# EAGLE design openThermostatShield (EAGLE 6.4)
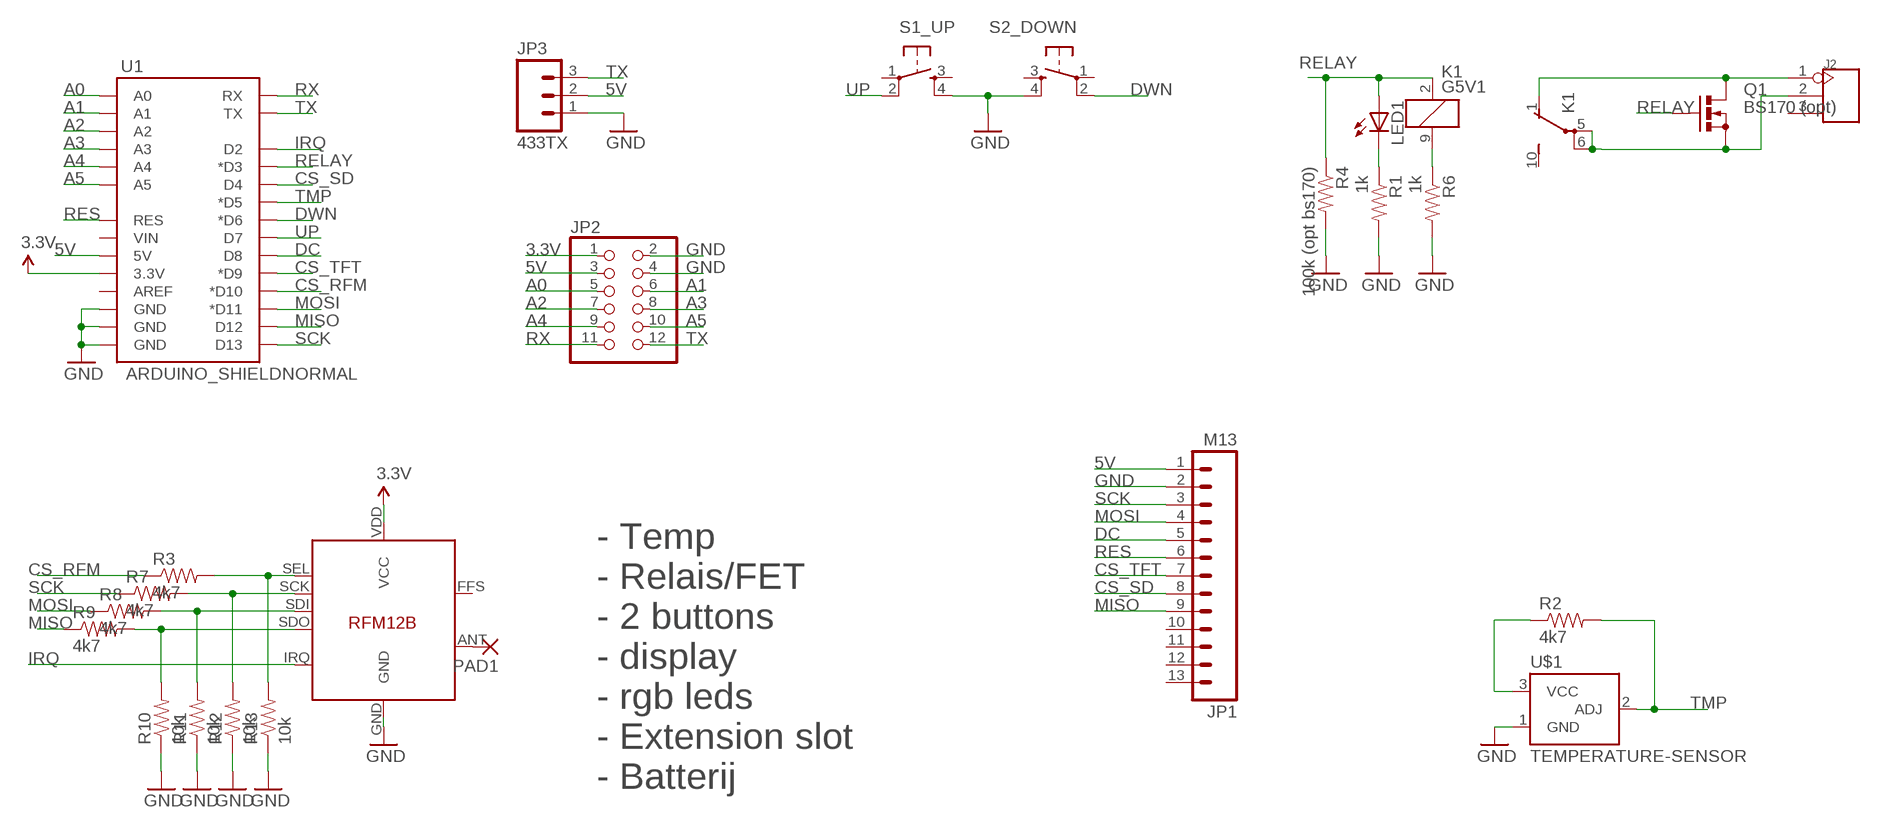
[diagram p0: schematic, sheet 1]

## Parts
J2  SCREW-TERMINAL-3P'5.08'  [3P-5.08]
JP1  M13  [1X13]
JP2  PINHD-2X6/90  [2X06/90]
JP3  433TX  M03POLAR  [MOLEX-1X3]
K1  G5V1  [G5V1]
LED1  LED-3MM-NO_SILK  [LED3MM-NS]
PAD1  1,6/0,8  [1,6/0,8]
Q1  BS170 (opt)  BS170  [SOT54E]
R1  1k  RESISTORAXIAL-0.3  [AXIAL-0.3]
R2  4k7  RESISTORAXIAL-0.3  [AXIAL-0.3]
R3  4k7  RESISTORAXIAL-0.3  [AXIAL-0.3]
R4  100k (opt bs170)  RESISTORAXIAL-0.3  [AXIAL-0.3]
R6  1k  RESISTORAXIAL-0.3  [AXIAL-0.3]
R7  4k7  RESISTORAXIAL-0.3  [AXIAL-0.3]
R8  4k7  RESISTORAXIAL-0.3  [AXIAL-0.3]
R9  4k7  RESISTORAXIAL-0.3  [AXIAL-0.3]
R10  10k  RESISTORAXIAL-0.3  [AXIAL-0.3]
R11  10k  RESISTORAXIAL-0.3  [AXIAL-0.3]
R12  10k  RESISTORAXIAL-0.3  [AXIAL-0.3]
R13  10k  RESISTORAXIAL-0.3  [AXIAL-0.3]
S1_UP  TAC_SWITCHPTH  [TACTILE-PTH]
S2_DOWN  TAC_SWITCHPTH  [TACTILE-PTH]
U1  ARDUINO_SHIELDNORMAL  [DUEMILANOVE_SHIELD_5X5]
U$1  TEMPERATURE-SENSOR  [TO-92]
U$2  RFM12B  [RFM12B]

## Nets
3.3V [power]: JP2.1 U1.3.3V U$2.VDD(VCC)
5V [power]: JP1.1 JP2.3 JP3.2 U1.5V
A0: JP2.5 U1.A0
A1: JP2.6 U1.A1
A2: JP2.7 U1.A2
A3: JP2.8 U1.A3
A4: JP2.9 U1.A4
A5: JP2.10 U1.A5
CS_RFM: R3.P$1 U1.D10(*D10)
CS_SD: JP1.8 U1.D4
CS_TFT: JP1.7 U1.D9(*D9)
DC: JP1.5 U1.D8
DWN: S2_DOWN.2 U1.D6(*D6)
GND [power]: JP1.2 JP2.2 JP2.4 JP3.1 R1.P$2 R4.P$2 R6.P$2 R10.P$1 R11.P$1 R12.P$1 R13.P$1 S1_UP.4 S2_DOWN.4 U1.GND@0(GND) U1.GND@1(GND) U1.GND@2(GND) U$1.1(GND) U$2.GND
IRQ: U1.D2 U$2.IRQ
MISO: JP1.9 R9.P$1 U1.D12
MOSI: JP1.4 R8.P$1 U1.D11(*D11)
N$1: K1.9 R6.P$1
N$2: J2.1 K1.1(2:O) Q1.D
N$3: LED1.K(C) R1.P$1
N$4: J2.2 K1.5(2:P) K1.6(2:P) Q1.S
N$8: R2.P$1 U$1.3(VCC)
N$11: PAD1.1(P) U$2.ANT
N$12: R9.P$2 R10.P$2 U$2.SDO
N$13: R8.P$2 R11.P$2 U$2.SDI
N$14: R7.P$2 R12.P$2 U$2.SCK
N$15: R3.P$2 R13.P$2 U$2.SEL
RELAY: K1.2 LED1.A Q1.G R4.P$1 U1.D3(*D3)
RES: JP1.6 U1.RES
RX: JP2.11 U1.RX
SCK: JP1.3 R7.P$1 U1.D13
TMP: R2.P$2 U1.D5(*D5) U$1.2(ADJ)
TX: JP2.12 JP3.3 U1.TX
UP: S1_UP.2 U1.D7
Unconnected: J2.3 JP1.10 JP1.11 JP1.12 JP1.13 K1.10(2:S) S1_UP.1 S1_UP.3 S2_DOWN.1 S2_DOWN.3 U1.AREF U1.VIN U$2.FFS

## Notes on the sheet
- - Temp
  - Relais/FET
  - 2 buttons
  - display
  - rgb leds
  - Extension slot
  - Batterij

## Library data of the parts
J2 = Connector:SCREW-TERMINAL-3P
JP1 = SparkFun-Connectors:M13: 13-pin single row .1" header
JP2 = pinhead:PINHD-2X6: PIN HEADER
JP3 = SparkFun-Connectors:M03: Header 3 Standard 3-pin 0.1" header. Use with straight break away headers (SKU : PRT-00116), right angle break away headers (PRT-00553), swiss pins (PRT-00743), machine pins (PRT-00117), and female headers (PRT-00115). Molex polarized connector foot print use with SKU : PRT-08232 with associated crimp pins and housings.
K1 = relay:G5V1: RELAY 1 x switch, 0.5 A/125 V AC, 1 A/24 V DC , Omron; MPN: G5V-1-DC24; OC_FARNELL: 9949593; OC_NEWARK: 36M6377
LED1 = SparkFun-LED:LED: LEDs Standard schematic elements and footprints for 5mm, 3mm, 1206, and 0603 sized LEDs. 5mm - Spark Fun Electronics SKU : COM-00529 (and others)
PAD1 = wirepad:1,6/0,8: THROUGH-HOLE PAD
Q1 = transistor-small-signal:BS170: N-CHANNEL MOS FET
R1-R4 R6-R13 = SparkFun-Passives:RESISTOR: Resistor Basic schematic elements and footprints for 0603, 1206, and PTH resistors.
S1_UP S2_DOWN = SparkFun-Electromechanical:TAC_SWITCH: Momentary Switch Button commonly used for reset or general input. Spark Fun Electronics SKU : COM-00097 SMT- SWCH-08247
U1 = SparkFun-Boards:ARDUINO_SHIELD: Arduino shield footprint
U$1 = SparkFun-Sensors:TEMPERATURE-SENSOR: TO-92 temp sensor
U$2 = JeeLabs:RFM12B

## Net classes
1 power: width 0.381 mm, clearance 0.254 mm

## Board
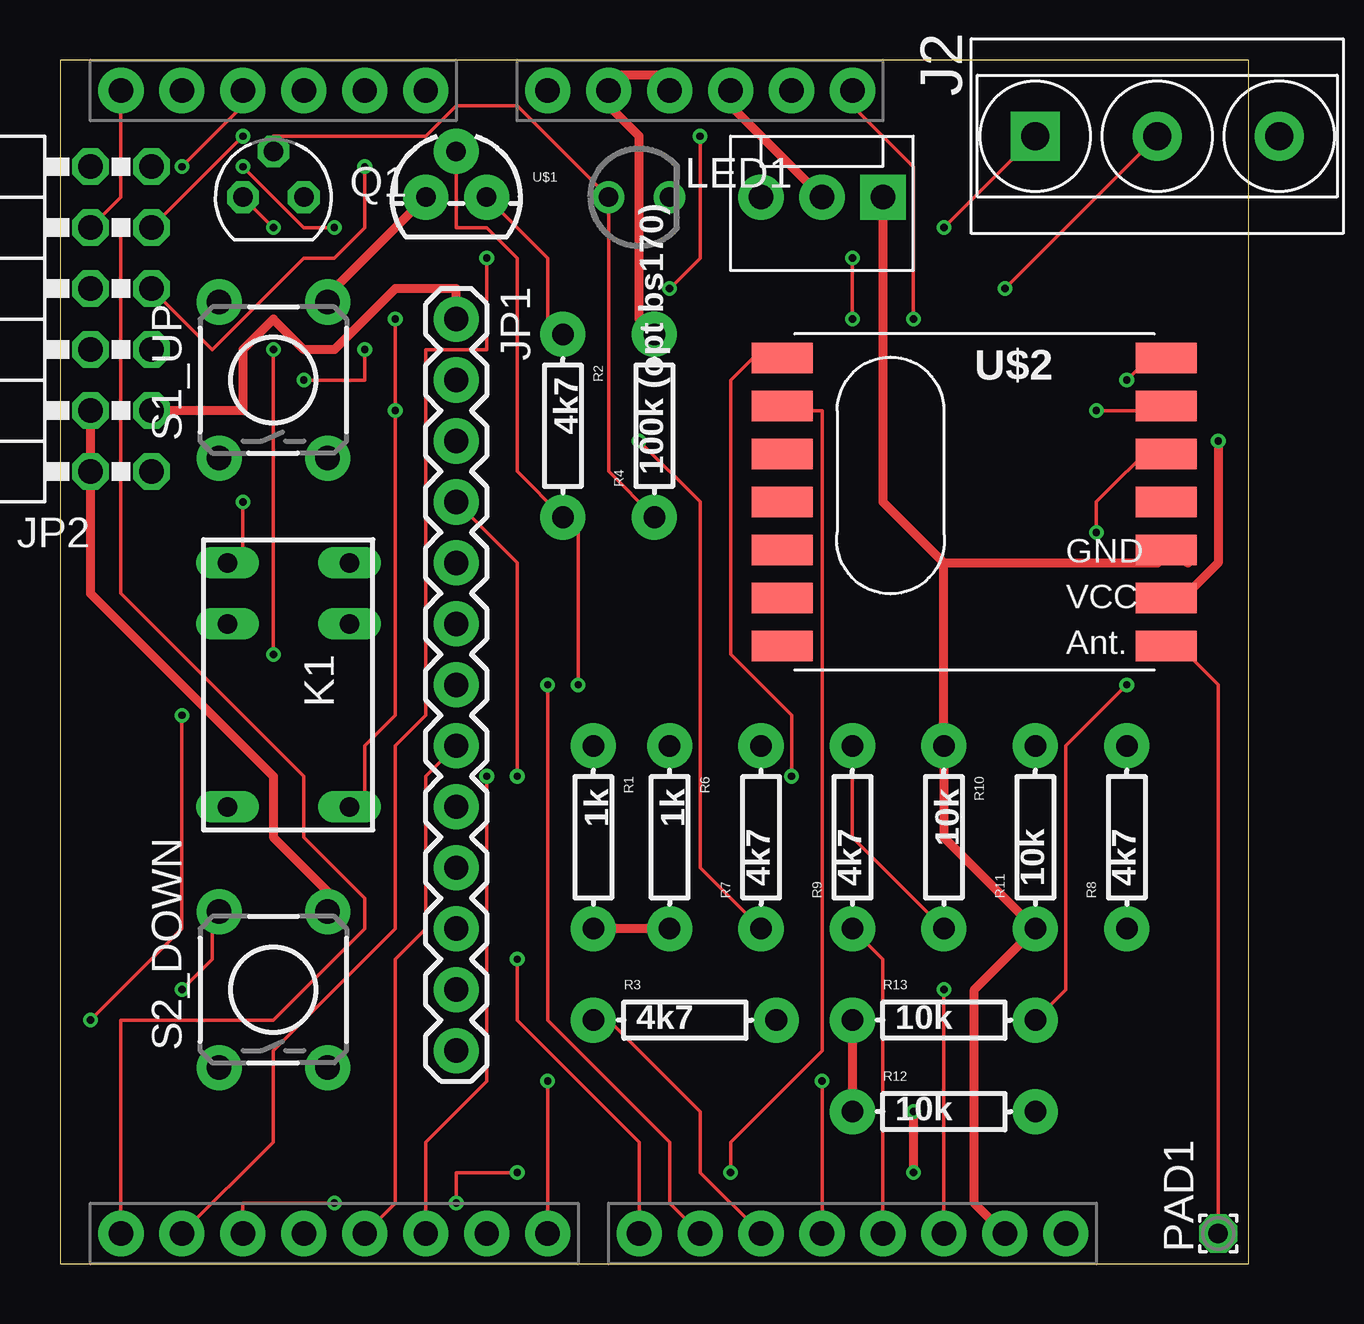
[diagram p1: board, top side]
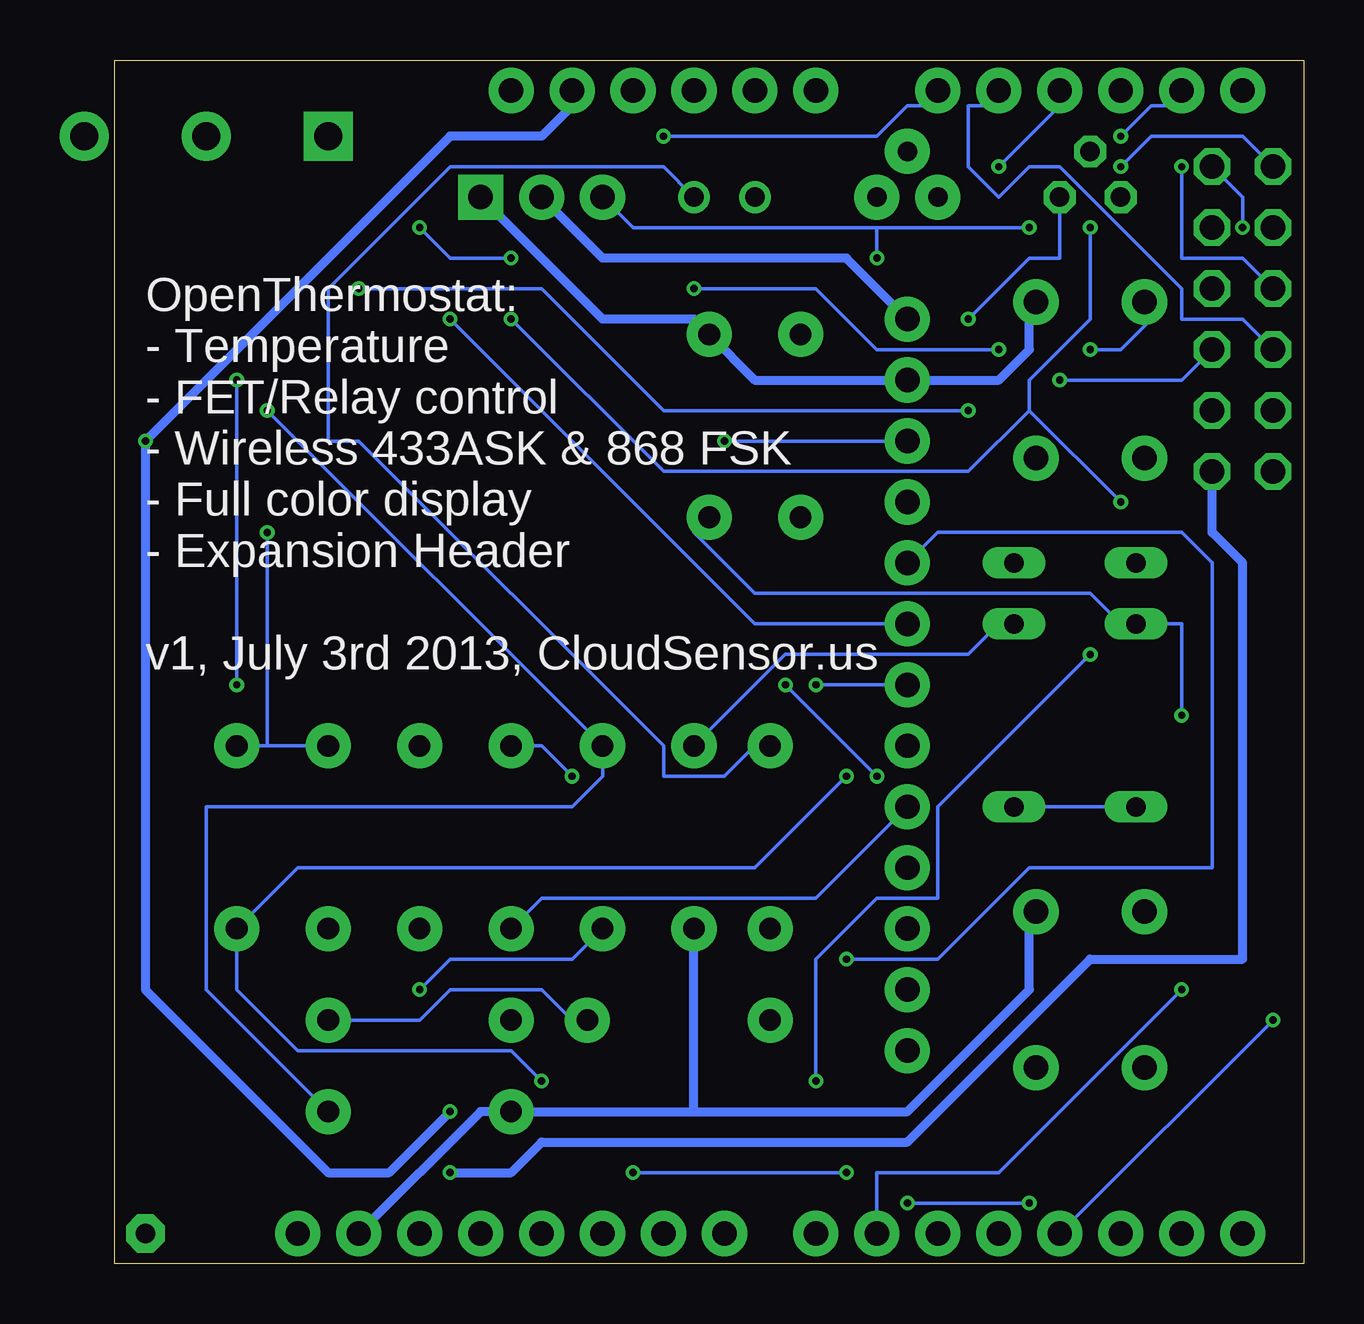
[diagram p2: board, bottom side, seen from below]

Size 49.53 x 50.17 mm. Coordinates in mm from the lower left corner, seen from the top.
Copper layers (1*16): Top 0.035mm / dielectric 1.5mm / Bottom 0.035mm
Design rules "ITEADstudio_DRC": minimum track width 6mil, minimum drill 12mil, track to track 6mil, track to pad 6mil, pad to pad 6mil, via to via 6mil, smd to smd 0mil, copper to edge 10mil, drill to drill 10mil, minimum pad ring 10mil, minimum via ring 6mil, stop-mask expansion 2mil, vias tented up to drill 100mil, thermal gap 10mil

### Footprints (pad centres in the part's own frame; a part is rotated, then mirrored left to right if it is on the bottom)
3P-5.08 = drill 1.168 pad 2.032 square: 1 0,5.08 | drill 1.168 pad 2.032: 2 0,0; 3 0,-5.08
1X13 = drill 1.016 pad 1.88: 1 0,0; 2 2.54,0; 3 5.08,0; 4 7.62,0; 5 10.16,0; 6 12.7,0; 7 15.24,0; 8 17.78,0; 9 20.32,0; 10 22.86,0; 11 25.4,0; 12 27.94,0; 13 30.48,0
2X06/90 = drill 1.016 octagon: 1 -6.35,-6.35; 2 -6.35,-3.81; 3 -3.81,-6.35; 4 -3.81,-3.81; 5 -1.27,-6.35; 6 -1.27,-3.81; 7 1.27,-6.35; 8 1.27,-3.81; 9 3.81,-6.35; 10 3.81,-3.81; 11 6.35,-6.35; 12 6.35,-3.81
MOLEX-1X3 = drill 1.016 pad 1.88 square: 1 0,0 | drill 1.016 pad 1.88: 2 2.54,0; 3 5.08,0
G5V1 = drill 0.813 long: 1 -5.08,-2.54; 2 -2.54,-2.54; 5 5.08,-2.54; 6 5.08,2.54; 9 -2.54,2.54; 10 -5.08,2.54
LED3MM-NS = drill 0.813: A -1.27,0; K 1.27,0
1,6/0,8 = drill 0.813 pad 1.6 octagon: 1 0,0
SOT54E = drill 0.813 octagon: D -1.27,0; G 0,1.905; S 1.27,0
AXIAL-0.3 = drill 0.9 pad 1.88: P$1 -3.81,0; P$2 3.81,0
TACTILE-PTH = drill 1.016 pad 1.88: 1 -3.251,2.261; 2 3.251,2.261; 3 -3.251,-2.261; 4 3.251,-2.261
DUEMILANOVE_SHIELD_5X5 = drill 1.016 pad 1.88: 3.3V 50.165,26.67; 5V 50.165,29.21; A0 50.165,41.91; A1 50.165,44.45; A2 50.165,46.99; A3 50.165,49.53; A4 50.165,52.07; A5 50.165,54.61; AREF 2.54,15.24; D2 2.54,49.53; D3 2.54,46.99; D4 2.54,44.45; D5 2.54,41.91; D6 2.54,39.37; D7 2.54,36.83; D8 2.54,33.02; D9 2.54,30.48; D10 2.54,27.94; D11 2.54,25.4; D12 2.54,22.86; D13 2.54,20.32; GND@0 50.165,31.75; GND@1 50.165,34.29; GND@2 2.54,17.78; RES 50.165,24.13; RX 2.54,54.61; TX 2.54,52.07; VIN 50.165,36.83
TO-92 = drill 0.813 pad 1.88: 1 -1.27,0; 2 0,1.905; 3 1.27,0
RFM12B = smd 2.54 x 1.27: ANT 8,-6; FFS -8,2; GND 8,-2; IRQ -8,4; P$8 -8,0; P$9 -8,-2; P$10 -8,-4; P$12 -8,-6; P$16 8,0; SCK 8,4; SDI 8,2; SDO -8,6; SEL 8,6; VDD 8,-4

### Placement (x,y rotation side)
J2  45.72,46.99 90 top
JP1  16.51,39.37 270 top
JP2  -2.54,39.37 90 top
JP3  34.29,44.45 180 top
K1  9.52,24.13 270 top
LED1  24.13,44.45 0 top
PAD1  48.26,1.27 90 top
Q1  8.89,44.45 0 top
R1  22.22,17.78 270 top
R2  20.95,34.93 270 top
R3  26.03,10.16 0 top
R4  24.76,34.93 90 top
R6  25.4,17.78 270 top
R7  29.21,17.78 90 top
R8  44.45,17.78 90 top
R9  33.02,17.78 90 top
R10  36.83,17.78 270 top
R11  40.64,17.78 90 top
R12  36.83,6.35 0 top
R13  36.83,10.16 0 top
S1_UP  8.89,36.83 90 top
S2_DOWN  8.89,11.43 90 top
U1  57.15,-1.27 90 top
U$1  16.51,44.45 0 top
U$2  38.1,31.75 0 top

### Tracks (layer width: path | path; a pad name or v marks a point on that pad's centre or on a via)
3.3V  (via drill 0.3)
  Top 0.381: v48.26,34.29 48.26,29.21 46.99,27.94 U$2.VDD | v35.56,6.35 v35.56,3.81
  Bottom 0.381: U1.3.3V 30.48,48.26 31.75,46.99 35.56,46.99 v48.26,34.29 48.26,11.43 40.64,3.81 38.1,3.81 v35.56,6.35 | JP2.1 3.81,30.48 2.54,29.21 2.54,12.7 8.89,12.7 16.51,5.08 31.75,5.08 33.02,3.81 v35.56,3.81
5V
  Top 0.381: JP3.2 27.94,48.26 U1.5V | JP2.3 7.62,35.56 7.62,38.1 8.89,39.37 10.16,38.1 11.43,38.1 13.97,40.64 16.51,40.64 JP1.1
  Bottom 0.381: JP3.2 29.21,41.91 19.05,41.91 JP1.1
A0  (via drill 0.3)
  Top 0.152: v10.16,36.83 12.7,36.83 v12.7,38.1 | v25.4,40.64 26.67,41.91 v26.67,46.99
  Bottom 0.152: JP2.5 5.08,36.83 v10.16,36.83 | v12.7,38.1 17.78,38.1 20.32,40.64 v25.4,40.64 | v26.67,46.99 17.78,46.99 16.51,48.26 15.24,48.26 U1.A0
A1
  Bottom 0.152: JP2.6 2.54,39.37 5.08,39.37 5.08,40.64 10.16,45.72 11.43,45.72 12.7,44.45 13.97,45.72 13.97,48.26 12.7,48.26 U1.A1
A2  (via drill 0.3)
  Top 0.152: JP2.7 6.35,38.1 10.16,41.91 11.43,41.91 12.7,43.18 v12.7,45.72
  Bottom 0.152: v12.7,45.72 10.16,48.26 U1.A2
A3  (via drill 0.3)
  Top 0.152: v5.08,45.72 7.62,48.26 U1.A3
  Bottom 0.152: JP2.8 2.54,41.91 5.08,41.91 v5.08,45.72
A4  (via drill 0.3)
  Top 0.152: v7.62,46.99 JP2.9
  Bottom 0.152: v7.62,46.99 6.35,48.26 5.08,48.26 U1.A4
A5
  Top 0.152: JP2.10 2.54,44.45 U1.A5
CS_RFM
  Top 0.152: U1.D10 26.67,3.81 26.67,6.35 22.86,10.16 R3.P$1
CS_SD
  Top 0.152: U1.D4 13.97,2.54 13.97,12.7 15.24,13.97 15.24,20.32 JP1.8
CS_TFT  (via drill 0.3)
  Top 0.152: v20.32,24.13 20.32,10.16 25.4,5.08 25.4,2.54 U1.D9
  Bottom 0.152: v20.32,24.13 JP1.7
DC  (via drill 0.3)
  Top 0.152: v19.05,12.7 19.05,10.16 24.13,5.08 U1.D8
  Bottom 0.152: JP1.5 15.24,30.48 5.08,30.48 3.81,29.21 3.81,16.51 11.43,16.51 15.24,12.7 v19.05,12.7
DWN  (via drill 0.3)
  Top 0.152: v5.08,11.43 6.35,12.7 6.35,13.97 S2_DOWN.2
  Bottom 0.152: U1.D6 17.78,3.81 12.7,3.81 v5.08,11.43
GND
  Top 0.381: 46.99,29.21 U$2.GND 45.72,29.21 36.83,29.21 | 36.83,29.21 R10.P$1 36.83,17.78 R11.P$1 38.1,11.43 38.1,2.54 U1.GND@2 | U$1.1 11.43,40.64 S1_UP.4 | U1.GND@0 25.4,49.53 22.86,49.53 U1.GND@1 22.86,48.26 24.13,46.99 24.13,39.37 R4.P$2 | 36.83,29.21 34.29,31.75 JP3.1 | JP2.4 JP2.2 1.27,27.94 8.89,20.32 8.89,17.78 11.43,15.24 S2_DOWN.4 | R6.P$2 R1.P$2 | R13.P$1 R12.P$1
  Bottom 0.381: JP3.1 29.21,39.37 25.4,39.37 R4.P$2 22.86,36.83 JP1.2 12.7,36.83 11.43,38.1 11.43,39.37 S1_UP.4 | U1.GND@2 34.29,6.35 R12.P$1 25.4,6.35 | 25.4,6.35 R6.P$2 | 25.4,6.35 16.51,6.35 11.43,11.43 11.43,13.97 S2_DOWN.4
IRQ  (via drill 0.3)
  Top 0.152: v27.94,3.81 27.94,5.08 31.75,8.89 31.75,35.56 30.48,35.56 U$2.IRQ | v19.05,3.81 16.51,3.81 v16.51,2.54 | v11.43,2.54 7.62,2.54 U1.D2
  Bottom 0.152: v19.05,3.81 v27.94,3.81 | v11.43,2.54 v16.51,2.54
MISO
  Top 0.152: R9.P$1 34.29,12.7 U1.D12
  Bottom 0.152: JP1.9 20.32,15.24 31.75,15.24 R9.P$1
MOSI  (via drill 0.3)
  Top 0.152: v31.75,7.62 U1.D11 | JP1.4 19.05,29.21 v19.05,20.32
  Bottom 0.152: v31.75,7.62 33.02,8.89 41.91,8.89 44.45,11.43 R8.P$1 41.91,16.51 22.86,16.51 v19.05,20.32
N$1
  Bottom 0.152: R6.P$1 21.59,25.4 13.97,25.4 12.7,26.67 K1.9
N$2  (via drill 0.3)
  Top 0.152: v7.62,31.75 7.62,29.21 K1.1 | Q1.D v8.89,43.18 | v36.83,43.18 J2.1 | v33.02,39.37 v33.02,41.91
  Bottom 0.152: 11.43,35.56 v7.62,31.75 | 11.43,35.56 11.43,36.83 8.89,39.37 v8.89,43.18 | v36.83,43.18 35.56,41.91 v33.02,41.91 | v33.02,39.37 26.67,33.02 13.97,33.02 11.43,35.56
N$3
  Bottom 0.152: LED1.K 26.67,45.72 35.56,45.72 40.64,40.64 40.64,34.29 39.37,34.29 26.67,21.59 26.67,20.32 24.13,20.32 22.86,21.59 R1.P$1
N$4  (via drill 0.3)
  Top 0.152: v13.97,39.37 v13.97,35.56 13.97,22.86 12.7,21.59 12.7,19.05 K1.6 | v39.37,40.64 J2.2
  Bottom 0.152: K1.6 K1.5 | Q1.S 10.16,41.91 11.43,41.91 v13.97,39.37 | v39.37,40.64 31.75,40.64 26.67,35.56 v13.97,35.56
N$8
  Top 0.152: U$1.3 20.32,41.91 20.32,39.37 R2.P$1
N$11
  Top 0.152: PAD1.1 48.26,24.13 46.99,25.4 U$2.ANT
N$12  (via drill 0.3)
  Top 0.152: v30.48,20.32 30.48,22.86 27.94,25.4 27.94,36.83 29.21,38.1 U$2.SDO | R10.P$2 33.02,17.78 R9.P$2
  Bottom 0.152: v30.48,20.32 31.75,21.59 R9.P$2
N$13  (via drill 0.3)
  Top 0.152: v43.18,30.48 43.18,31.75 45.72,34.29 U$2.SDI
  Bottom 0.152: 43.18,21.59 v43.18,30.48 | R8.P$2 43.18,21.59 | 43.18,21.59 R11.P$2
N$14  (via drill 0.3)
  Top 0.152: v43.18,35.56 45.72,35.56 U$2.SCK
  Bottom 0.152: v43.18,35.56 R7.P$2 29.21,20.32 30.48,19.05 45.72,19.05 45.72,11.43 R12.P$2
N$15  (via drill 0.3)
  Top 0.152: v44.45,36.83 45.72,38.1 U$2.SEL | v44.45,24.13 41.91,21.59 41.91,11.43 R13.P$2
  Bottom 0.152: v44.45,24.13 v44.45,36.83 | R13.P$2 36.83,10.16 35.56,11.43 31.75,11.43 30.48,10.16 R3.P$2
RELAY  (via drill 0.3)
  Top 0.152: R4.P$1 22.86,33.02 LED1.A 19.05,48.26 16.51,48.26 15.24,46.99 8.89,46.99 Q1.G | v1.27,10.16 5.08,13.97 v5.08,22.86
  Bottom 0.152: R4.P$1 25.4,30.48 22.86,27.94 8.89,27.94 7.62,26.67 K1.2 5.08,26.67 v5.08,22.86 | v1.27,10.16 U1.D3
RES  (via drill 0.3)
  Top 0.152: v35.56,39.37 35.56,45.72 33.02,48.26 U1.RES
  Bottom 0.152: JP1.6 22.86,26.67 v35.56,39.37
RX  (via drill 0.3)
  Top 0.152: v2.54,43.18 2.54,27.94 10.16,20.32 10.16,17.78 12.7,15.24 12.7,13.97 8.89,10.16 2.54,10.16 U1.RX
  Bottom 0.152: JP2.11 2.54,44.45 v2.54,43.18
SCK  (via drill 0.3)
  Top 0.152: v36.83,11.43 U1.D13 | v24.13,34.29 26.67,31.75 26.67,16.51 R7.P$1
  Bottom 0.152: v36.83,11.43 35.56,12.7 30.48,12.7 R7.P$1 | v24.13,34.29 JP1.3
TMP  (via drill 0.3)
  Top 0.152: U1.D5 15.24,5.08 17.78,7.62 v17.78,20.32 | v21.59,24.13 21.59,30.48 R2.P$2 19.05,33.02 19.05,41.91 17.78,43.18 16.51,43.18 U$1.2
  Bottom 0.152: v21.59,24.13 v17.78,20.32
TX  (via drill 0.3)
  Top 0.152: v7.62,45.72 10.16,43.18 v11.43,43.18 | U1.TX 8.89,5.08 8.89,8.89 13.97,13.97 13.97,21.59 15.24,22.86 15.24,38.1 17.78,38.1 v17.78,41.91
  Bottom 0.152: JP2.12 2.54,46.99 6.35,46.99 v7.62,45.72 | 17.78,43.18 27.94,43.18 JP3.3 | 17.78,43.18 v11.43,43.18 | 17.78,43.18 v17.78,41.91
UP  (via drill 0.3)
  Top 0.152: v8.89,25.4 v8.89,38.1 | U1.D7 v20.32,7.62
  Bottom 0.152: v8.89,38.1 7.62,38.1 6.35,39.37 S1_UP.2 | v8.89,25.4 15.24,19.05 15.24,15.24 17.78,15.24 20.32,12.7 v20.32,7.62

### Text on the board
bNames: OpenThermostat: / - Temperature / - FET/Relay control / - Wireless 433ASK & 868 FSK / - Full color display / - Expansion Header / / v1, July 3rd 2013, CloudSensor.us